# EAGLE design Board 2 (EAGLE 7.2.0)
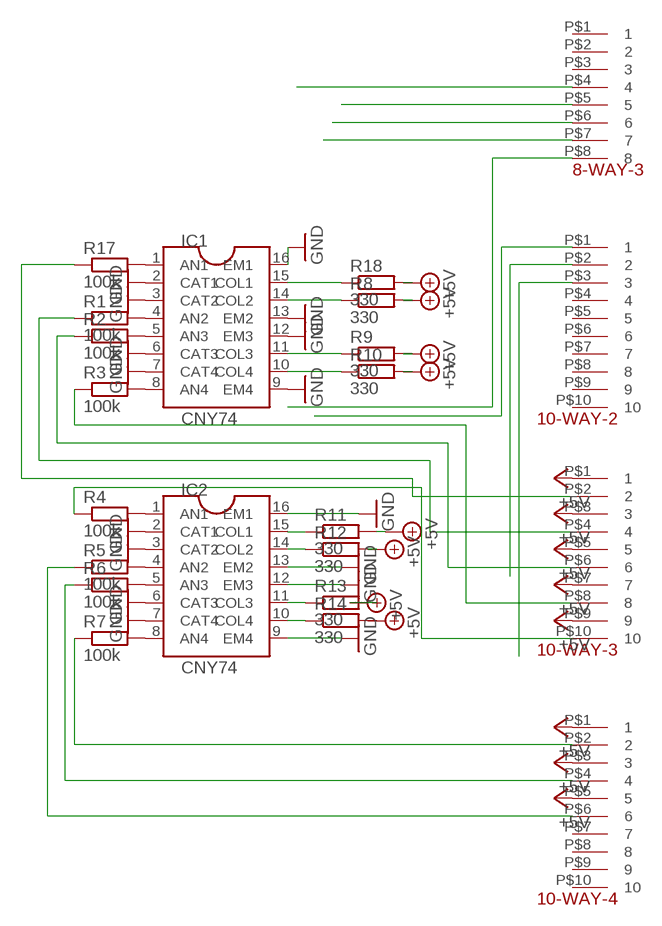
[diagram p0: schematic, sheet 1]

## Parts
8-WAY-3  SDH8PIN  [SDH8PIN]
10-WAY-2  SDH10PIN  [SDH10PIN]
10-WAY-3  SDH10PIN  [SDH10PIN]
10-WAY-4  SDH10PIN  [SDH10PIN]
IC1  IC-CNY74-16DIL  [IC-CNY74-16DIL]
IC2  IC-CNY74-16DIL  [IC-CNY74-16DIL]
R1  100k  R-EU_0613/5V  [P0613V]
R2  100k  R-EU_0613/5V  [P0613V]
R3  100k  R-EU_0613/5V  [P0613V]
R4  100k  R-EU_0613/5V  [P0613V]
R5  100k  R-EU_0613/5V  [P0613V]
R6  100k  R-EU_0613/5V  [P0613V]
R7  100k  R-EU_0613/5V  [P0613V]
R8  330  R-EU_0613/5V  [P0613V]
R9  330  R-EU_0613/5V  [P0613V]
R10  330  R-EU_0613/5V  [P0613V]
R11  330  R-EU_0613/5V  [P0613V]
R12  330  R-EU_0613/5V  [P0613V]
R13  330  R-EU_0613/5V  [P0613V]
R14  330  R-EU_0613/5V  [P0613V]
R17  100k  R-EU_0613/5V  [P0613V]
R18  330  R-EU_0613/5V  [P0613V]

## Nets
+5V: 10-WAY-3.P$1 10-WAY-3.P$3 10-WAY-3.P$5 10-WAY-3.P$7 10-WAY-3.P$9 10-WAY-4.P$1 10-WAY-4.P$3 10-WAY-4.P$5 R8.2 R9.2 R10.2 R11.2 R12.2 R13.2 R18.2
GND: IC1.2(CAT1) IC1.3(CAT2) IC1.6(CAT3) IC1.7(CAT4) IC1.9(EM4) IC1.12(EM3) IC1.13(EM2) IC1.16(EM1) IC2.2(CAT1) IC2.3(CAT2) IC2.6(CAT3) IC2.7(CAT4) IC2.9(EM4) IC2.12(EM3) IC2.13(EM2) IC2.16(EM1)
N$1: IC1.1(AN1) R17.2
N$2: IC1.4(AN2) R1.2
N$3: IC1.5(AN3) R2.2
N$4: IC1.8(AN4) R3.2
N$5: IC2.1(AN1) R4.2
N$6: IC2.4(AN2) R5.2
N$7: IC2.5(AN3) R6.2
N$8: IC2.8(AN4) R7.2
N$9: 10-WAY-3.P$8 R3.1
N$10: 10-WAY-3.P$6 R2.1
N$11: 10-WAY-3.P$4 R1.1
N$12: 10-WAY-3.P$2 R17.1
N$13: 10-WAY-3.P$10 R4.1
N$14: 10-WAY-4.P$2 R7.1
N$15: 10-WAY-2.P$3
N$16: 10-WAY-4.P$4 R6.1
N$17: 10-WAY-4.P$6 R5.1
N$19: 10-WAY-2.P$1
N$20: 8-WAY-3.P$5
N$21: IC1.14(COL2) R8.1
N$22: 8-WAY-3.P$4
N$23: 8-WAY-3.P$6
N$24: 8-WAY-3.P$7
N$25: IC1.11(COL3) R9.1
N$26: 10-WAY-2.P$2
N$27: 8-WAY-3.P$8
N$28: IC1.10(COL4) R10.1
N$29: IC1.15(COL1) R18.1
N$30: IC2.14(COL2) R12.1
N$31: IC2.15(COL1) R11.1
N$32: IC2.11(COL3) R13.1
N$33: IC2.10(COL4) R14.1
Unconnected: 8-WAY-3.P$1 8-WAY-3.P$2 8-WAY-3.P$3 10-WAY-2.P$4 10-WAY-2.P$5 10-WAY-2.P$6 10-WAY-2.P$7 10-WAY-2.P$8 10-WAY-2.P$9 10-WAY-2.P$10 10-WAY-4.P$7 10-WAY-4.P$8 10-WAY-4.P$9 10-WAY-4.P$10 R14.2

## Library data of the parts
8-WAY-3 = SDH10PIN:SDH8PIN
10-WAY-2-10-WAY-4 = SDH10PIN:SDH10PIN
IC1 IC2 = IC-CNY74 quad optoisolator:IC-CNY74-16DIL
R1-R14 R17 R18 = resistor:R-EU_: RESISTOR, European symbol

## Board
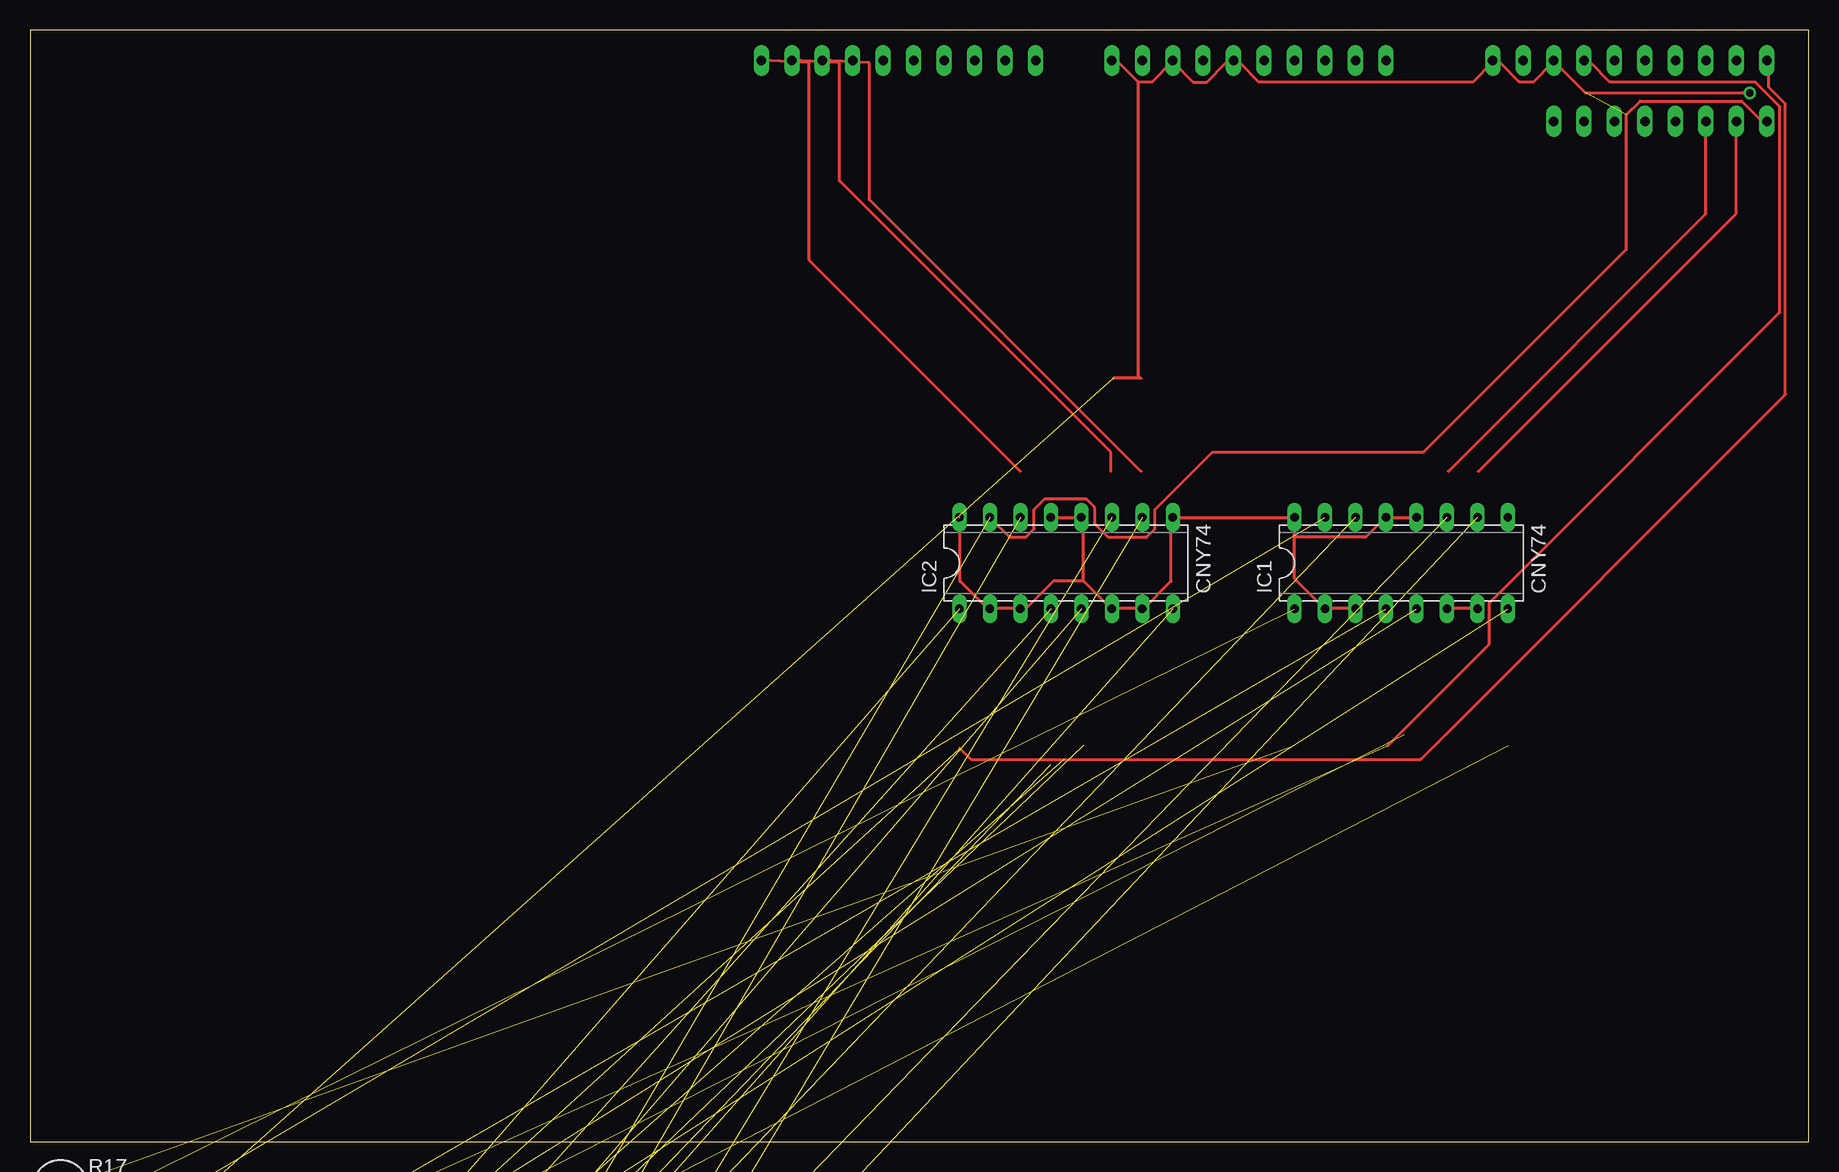
[diagram p1: board, top side]
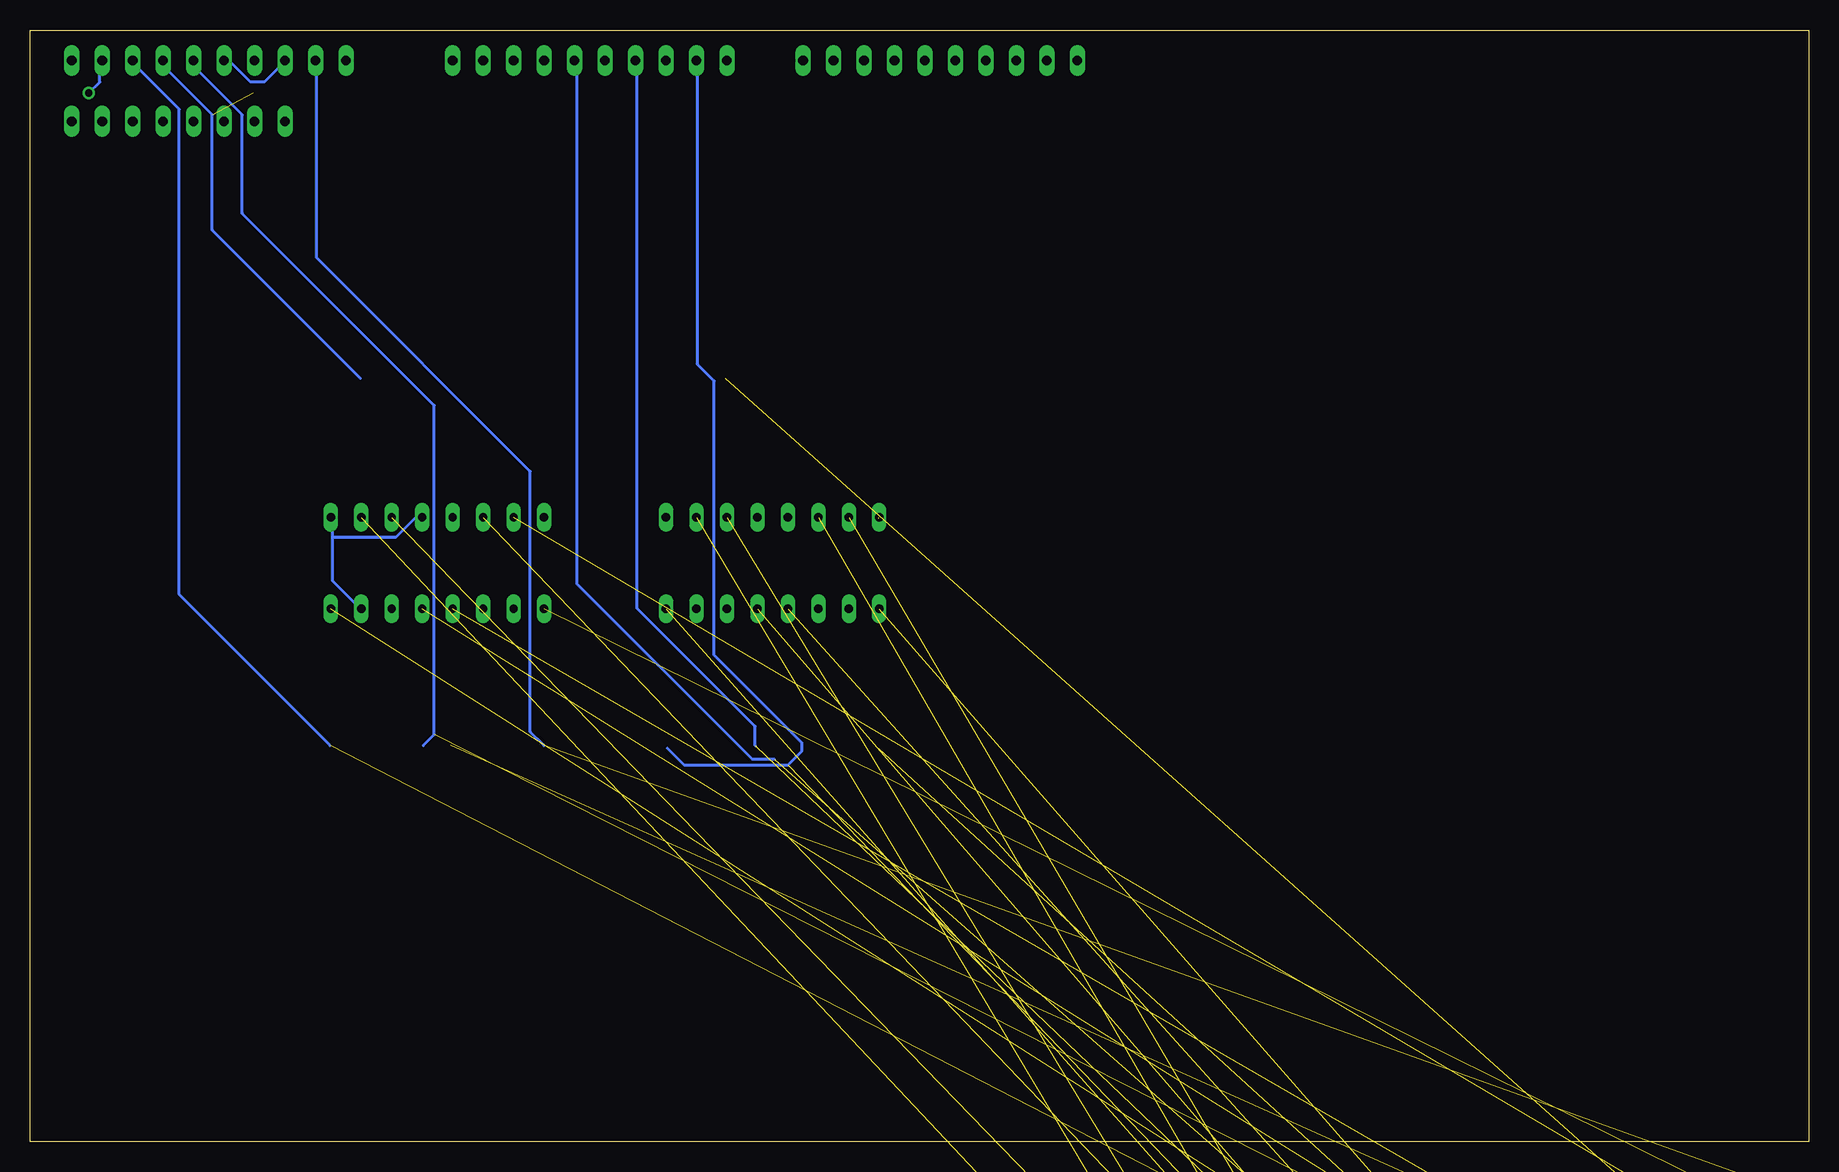
[diagram p2: board, bottom side, seen from below]

Size 148.26 x 92.7 mm. Coordinates in mm from the lower left corner, seen from the top.
Outline: 0,0 148.26,0 148.26,92.7 0,92.7 0,0
Copper layers (1*16): Top 0.035mm / dielectric 1.5mm / Bottom 0.035mm
Design rules "default": minimum track width 10mil, minimum drill 24mil, track to track 8mil, track to pad 8mil, pad to pad 8mil, via to via 8mil, smd to smd 8mil, copper to edge 40mil, drill to drill 8mil, minimum pad ring 10mil, minimum via ring 8mil, stop-mask expansion 4mil, vias tented up to drill 0mil, thermal gap 10mil

### Footprints (pad centres in the part's own frame; a part is rotated, then mirrored left to right if it is on the bottom)
SDH8PIN = drill 0.8 long: P$1 0,7.62; P$2 0,5.08; P$3 0,2.54; P$4 0,0; P$5 0,-2.54; P$6 0,-5.08; P$7 0,-7.62; P$8 0,-10.16
SDH10PIN = drill 0.8 long: P$1 0,12.7; P$2 0,10.16; P$3 0,7.62; P$4 0,5.08; P$5 0,2.54; P$6 0,0; P$7 0,-2.54; P$8 0,-5.08; P$9 0,-7.62; P$10 0,-10.16
IC-CNY74-16DIL = drill 0.7 long: 1 -3.81,8.89; 2 -3.81,6.35; 3 -3.81,3.81; 4 -3.81,1.27; 5 -3.81,-1.27; 6 -3.81,-3.81; 7 -3.81,-6.35; 8 -3.81,-8.89; 9 3.81,-8.89; 10 3.81,-6.35; 11 3.81,-3.81; 12 3.81,-1.27; 13 3.81,1.27; 14 3.81,3.81; 15 3.81,6.35; 16 3.81,8.89
P0613V = drill 1.016 octagon: 1 -2.54,0; 2 2.54,0

### Placement (x,y rotation side)
8-WAY-3  134.62,85.09 90 top
10-WAY-2  73.66,90.17 90 top
10-WAY-3  134.62,90.17 90 top
10-WAY-4  102.87,90.17 90 top
IC1  114.3,48.26 90 top
IC2  86.36,48.26 90 top
R1  5.08,-16.51 0 top  (outside the outline)
R2  5.08,-22.86 0 top  (outside the outline)
R3  5.08,-29.21 0 top  (outside the outline)
R4  5.08,-35.56 0 top  (outside the outline)
R5  5.08,-41.91 0 top  (outside the outline)
R6  5.08,-48.26 0 top  (outside the outline)
R7  5.08,-54.61 0 top  (outside the outline)
R8  5.08,-60.96 0 top  (outside the outline)
R9  5.08,-67.31 0 top  (outside the outline)
R10  5.08,-73.66 0 top  (outside the outline)
R11  5.08,-80.01 0 top  (outside the outline)
R12  5.08,-86.36 0 top  (outside the outline)
R13  5.08,-92.71 0 top  (outside the outline)
R14  5.08,-99.06 0 top  (outside the outline)
R17  5.08,-3.81 0 top  (outside the outline)
R18  5.08,-10.16 0 top  (outside the outline)

### Tracks (layer width: path | path; a pad name or v marks a point on that pad's centre or on a via)
+5V  (via drill 0.61)  (8 unrouted)
  Top 0.254: 92.38,88.37 90.78,89.97 90.32,89.97 10-WAY-4.P$1 | 92.38,88.37 93.52,88.37 95.12,89.97 10-WAY-4.P$3 95.35,89.97 96.95,88.37 98.09,88.37 99.69,89.97 100.15,89.97 10-WAY-4.P$5 100.38,89.97 100.84,89.97 102.44,88.37 120.27,88.37 121.87,89.97 10-WAY-3.P$1 122.1,89.97 122.56,89.97 124.16,88.37 125.3,88.37 126.9,89.97 10-WAY-3.P$3 127.13,89.97 129.64,87.45 v143.36,87.45 | 92.61,63.68 92.38,63.68 | 92.38,63.68 90.32,63.68 | 92.38,63.68 92.38,88.37
  Bottom 0.254: 10-WAY-3.P$5 131.93,89.97 131.47,89.97 129.87,88.37 128.73,88.37 127.13,89.97 10-WAY-3.P$3 | v143.36,87.45 142.44,88.37 142.44,89.97 10-WAY-3.P$9 | 120.73,63.68 133.07,76.02 133.07,85.62 136.96,89.51 136.96,89.97 10-WAY-3.P$7
GND  (1 unrouted)
  Top 0.254: 82.55,44.47 80.03,44.47 IC2.2 79.81,44.47 77.52,46.76 77.52,52.02 | IC2.13 85.29,52.02 87.58,52.02 IC2.12 87.81,52.02 87.81,46.76 | 87.81,46.76 90.09,44.47 IC2.6 90.32,44.47 92.61,44.47 IC2.7 92.84,44.47 95.12,46.76 95.12,52.02 IC2.9 95.35,52.02 105.41,52.02 | 82.55,44.47 83.01,44.47 85.29,46.76 87.81,46.76 | 82.55,44.47 IC2.3 | IC1.3 110.44,44.47 108.15,44.47 IC1.2 105.41,46.99 105.41,50.42 | 105.41,50.42 105.41,52.02 | IC1.12 115.47,52.02 113.18,52.02 IC1.13 112.95,52.02 111.35,50.42 105.41,50.42 | IC1.6 118.21,44.47 120.5,44.47 IC1.7 | 105.41,52.02 IC1.16
  Bottom 0.254: 123.01,50.42 123.01,46.76 120.73,44.47 IC1.7 | 123.01,50.42 123.01,52.02 IC1.9 | 123.01,50.42 117.75,50.42 116.15,52.02 115.7,52.02 IC1.12
N$1  (1 unrouted)
N$2  (1 unrouted)
N$3  (1 unrouted)
N$4  (1 unrouted)
N$5  (1 unrouted)
N$6  (1 unrouted)
N$7  (1 unrouted)
N$8  (1 unrouted)
N$9  (1 unrouted)
  Bottom 0.254: 123.24,33.05 135.81,45.62 135.81,86.08 139.7,89.97 10-WAY-3.P$8
N$10  (1 unrouted)
  Bottom 0.254: 115.47,33.05 114.55,33.96 114.55,61.39 130.56,77.39 130.56,85.62 134.44,89.51 134.44,89.97 10-WAY-3.P$6
N$11  (1 unrouted)
  Top 0.254: 113.18,33.05 121.64,41.5 121.64,44.93 145.87,69.16 145.87,86.31 143.81,88.37 131.7,88.37 130.1,89.97 129.64,89.97 10-WAY-3.P$4
N$12  (1 unrouted)
  Bottom 0.254: 105.41,33.05 106.55,34.19 106.55,55.91 124.38,73.74 124.38,89.97 10-WAY-3.P$2
N$13  (1 unrouted)
  Top 0.254: 77.52,32.82 78.44,31.9 115.93,31.9 146.33,62.31 146.33,86.54 144.96,87.91 144.96,89.97 10-WAY-3.P$10
N$14  (1 unrouted)
  Bottom 0.254: 95.12,32.82 93.75,31.45 85.06,31.45 83.92,32.59 83.92,33.27 91.24,40.59 91.24,63.45 92.61,64.82 92.61,89.97 10-WAY-4.P$2
N$15
  Top 0.254: 92.61,55.91 69.98,78.54 69.98,89.97 10-WAY-2.P$3
N$16  (1 unrouted)
  Bottom 0.254: 87.81,33.05 87.81,34.65 97.64,44.47 97.64,89.97 10-WAY-4.P$4
N$17  (1 unrouted)
  Bottom 0.254: 86.21,31.9 88.04,31.9 102.67,46.53 102.67,89.97 10-WAY-4.P$6
N$19
  Top 0.254: 82.55,55.91 64.95,73.51 64.95,89.97 10-WAY-2.P$1
N$21  (1 unrouted)
N$23
  Top 0.254: 8-WAY-3.P$6 139.7,77.39 118.21,55.91
N$24
  Top 0.254: 120.73,55.91 142.22,77.39 142.22,84.94 8-WAY-3.P$7
N$25  (1 unrouted)
N$26
  Top 0.254: 90.09,55.91 90.09,57.51 67.46,80.14 67.46,89.97 10-WAY-2.P$2
N$27
  Top 0.254: 80.03,52.02 81.64,50.42 83.01,50.42 83.69,51.11 83.69,52.7 84.61,53.62 88.04,53.62 88.72,52.93 88.72,51.56 89.86,50.42 93.07,50.42 93.75,51.11 93.75,52.7 98.55,57.51 116.15,57.51 133.07,74.42 133.07,85.62 134.21,86.77 142.67,86.77 144.27,85.17 144.73,85.17 8-WAY-3.P$8
N$28  (1 unrouted)
N$29  (1 unrouted)
N$30  (1 unrouted)
N$31  (1 unrouted)
N$32  (1 unrouted)
N$33  (1 unrouted)